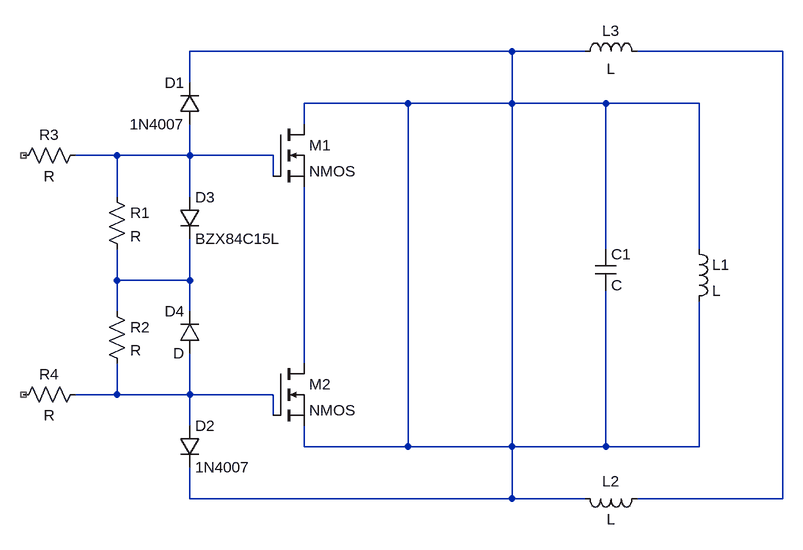
[diagram p0: schematic zvs_main_circuit.asc]
zvs_main_circuit.asc, the LTspice schematic file:
Version 4.1
SHEET 1 880 680
WIRE 0 -160 -496 -160
WIRE 112 -160 0 -160
WIRE 416 -160 192 -160
WIRE -496 -112 -496 -160
WIRE -160 -80 -320 -80
WIRE 0 -80 0 -160
WIRE 0 -80 -160 -80
WIRE 144 -80 0 -80
WIRE 288 -80 144 -80
WIRE -320 -48 -320 -80
WIRE -608 0 -672 0
WIRE -496 0 -496 -48
WIRE -496 0 -608 0
WIRE -368 0 -496 0
WIRE -368 32 -368 0
WIRE -608 64 -608 0
WIRE -496 64 -496 0
WIRE 144 144 144 -80
WIRE 288 144 288 -80
WIRE -608 192 -608 144
WIRE -496 192 -496 128
WIRE -496 192 -608 192
WIRE -608 240 -608 192
WIRE -496 240 -496 192
WIRE -320 320 -320 48
WIRE -608 368 -608 320
WIRE -608 368 -672 368
WIRE -496 368 -496 304
WIRE -496 368 -608 368
WIRE -368 368 -496 368
WIRE -368 400 -368 368
WIRE -496 416 -496 368
WIRE -320 448 -320 416
WIRE -160 448 -160 -80
WIRE -160 448 -320 448
WIRE 0 448 0 -80
WIRE 0 448 -160 448
WIRE 144 448 144 208
WIRE 144 448 0 448
WIRE 288 448 288 224
WIRE 288 448 144 448
WIRE -496 528 -496 480
WIRE 0 528 0 448
WIRE 0 528 -496 528
WIRE 112 528 0 528
WIRE 416 528 416 -160
WIRE 416 528 192 528
SYMBOL cap 128 144 R0
SYMATTR InstName C1
SYMBOL ind 272 128 R0
SYMATTR InstName L1
SYMBOL ind 208 512 R90
WINDOW 0 5 56 VBottom 2
WINDOW 3 32 56 VTop 2
SYMATTR InstName L2
SYMBOL ind 96 -144 R270
WINDOW 0 32 56 VTop 2
WINDOW 3 5 56 VBottom 2
SYMATTR InstName L3
SYMBOL nmos -368 -48 R0
SYMATTR InstName M1
SYMBOL nmos -368 320 R0
SYMATTR InstName M2
SYMBOL diode -480 -48 R180
WINDOW 0 24 64 Left 2
WINDOW 3 24 0 Left 2
SYMATTR InstName D1
SYMATTR Value 1N4007
SYMBOL diode -512 416 R0
SYMATTR InstName D2
SYMATTR Value 1N4007
SYMBOL diode -512 64 R0
SYMATTR InstName D3
SYMATTR Value BZX84C15L
SYMATTR Description Diode
SYMATTR Type diode
SYMBOL diode -480 304 R180
WINDOW 0 24 64 Left 2
WINDOW 3 24 0 Left 2
SYMATTR InstName D4
SYMBOL res -624 48 R0
SYMATTR InstName R1
SYMBOL res -624 224 R0
SYMATTR InstName R2
SYMBOL res -656 -16 R90
WINDOW 0 0 56 VBottom 2
WINDOW 3 32 56 VTop 2
SYMATTR InstName R3
SYMBOL res -656 352 R90
WINDOW 0 0 56 VBottom 2
WINDOW 3 32 56 VTop 2
SYMATTR InstName R4

The netlist it stands for:
* zvs_main_circuit.asc
C1 N001 N001 C
L1 N001 N001 L
L2 N002 N001 L
L3 N001 N002 L
M1 N001 N003 N005 N005 NMOS
M2 N005 N006 N001 N001 NMOS
D1 N003 N001 1N4007
D2 N006 N001 1N4007
D3 N003 N004 BZX84C15L
D4 N006 N004 D
R1 N003 N004 R
R2 N004 N006 R
R3 N003 NC_01 R
R4 N006 NC_02 R
.model D D
.lib standard.dio
.model NMOS NMOS
.model PMOS PMOS
.lib standard.mos
.backanno
.end